# EAGLE design controller (EAGLE 6.4)
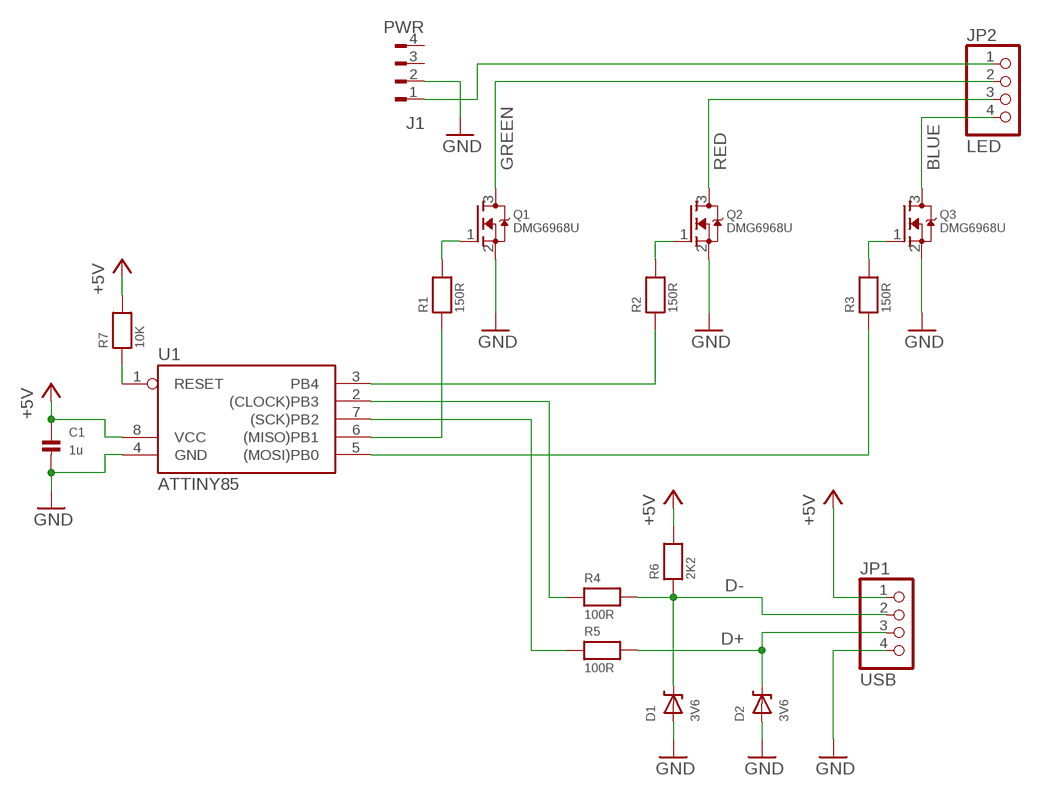
[diagram p0: schematic, sheet 1]

## Parts
C1  1u  CAP_CERAMIC0805  [0805]
D1  3V6  DIODE-ZENERSOD-323  [SOD-323]
D2  3V6  DIODE-ZENERSOD-323  [SOD-323]
J1  PWR  FLOP-4W827001  [827001]
JP1  USB  PINHD-1X4  [1X04]
JP2  LED  PINHD-1X4  [1X04]
Q1  DMG6968U  MOSFET-NWAVE  [SOT23-W]
Q2  DMG6968U  MOSFET-NWAVE  [SOT23-W]
Q3  DMG6968U  MOSFET-NWAVE  [SOT23-W]
R1  150R  RESISTOR0805  [0805]
R2  150R  RESISTOR0805  [0805]
R3  150R  RESISTOR0805  [0805]
R4  100R  RESISTOR0805  [0805]
R5  100R  RESISTOR0805  [0805]
R6  2K2  RESISTOR0805  [0805]
R7  10K  RESISTOR0805  [0805]
U1  ATTINY85  ATTINY85208MIL  [SOIC127P798X216-8N]

## Nets
+5V: C1.1 JP1.1 R6.2 R7.2 U1.8(VCC)
BLUE: JP2.4 Q3.3(D)
D+: D2.C JP1.3 R5.2
D-: D1.C JP1.2 R4.2 R6.1
GND: C1.2 D1.A D2.A J1.2 JP1.4 Q1.2(S) Q2.2(S) Q3.2(S) U1.4(GND)
GREEN: JP2.2 Q1.3(D)
MISO: R1.1 U1.6((MISO)PB1)
MOSI: R3.1 U1.5((MOSI)PB0)
N$1: Q1.1(G) R1.2
N$2: Q2.1(G) R2.2
N$3: Q3.1(G) R3.2
N$7: R4.1 U1.2((CLOCK)PB3)
N$8: J1.1 JP2.1
N$9: R2.1 U1.3(PB4)
RED: JP2.3 Q2.3(D)
RST: R7.1 U1.1(RESET)
SCK: R5.1 U1.7((SCK)PB2)
Unconnected: J1.3 J1.4

## Library data of the parts
C1 = microbuilder:CAP_CERAMIC: Ceramic Capacitors 0402 - 0402 Surface Mount Capacitors 16pF 50V 5% [Digikey: 445-4899-2-ND] 18pF 50V 5% [Digikey: 490-1281-2-ND] 22pF 50V 5% [Digikey: 490-1283-2-ND] 68pF 50V 5% [Digikey: 490-1289-2-ND] 0.1uF 10V 10% [Digikey: 490-1318-2-ND] 1.0uF 6.3V 10% [Digikey: 490-1320-2-ND] 0603 - 0603 Surface Mount Capacitors 16 pF 50V 5% [Digikey: 445-5051-2-ND] 22 pF 50V [Digikey: PCC220ACVTR-ND] 33 pF 50V 5% [Digikey: 490-1415-1-ND] 56pF 50V 5% [Digikey: 490-1421-1-ND] 220pF 50V 5% [Digikey: 445-1285-1-ND] 680 pF 50V 2200 pF 50V 5% C0G [Digikey: 445-1297-1-ND] 5600 pF 100V 5% X7R [Digikey: 478-3711-1-ND] 0.1 µF 25V 10% [Digikey: PCC2277TR-ND] 0.22 µF 16V 10% X7R [Digikey: 445-1318-1-ND] 1.0 µF 25V 10% [Digikey: 445-5146-2-ND] 0603 - RF Specific 3pF 250V +/-0.1pF RF [Digikey: 712-1347-1-ND] 18 pF 250V 5% [Digikey: 478-3505-1-ND or 712-1322-1-ND] 56 pF 250V 5% C0G RF [Digikey: 490-4867-1-ND] 68 pF 250V RF [Digikey: 490-4868-1-ND] 0805 - 0805 Surface Mount Capacitors 220 pF 250V 2% RF Ceramic Capacitor [Digikey: 712-1398-1-ND] 1000 pF 50V 2% NP0 Ceramic Capacitor [Digikey: 478-3760-1-ND] 0.1 µF 25V 10% Ceramic Capacitor [Digikey: PCC1828TR-ND] 1.0 µF 16V 10% Ceramic Capacitor[Digikey: 490-1691-2-ND] 10.0 µF 10V 10% Ceramic Capacitor[Digikey: 709-1228-1-ND] 10.0 uF 16V 10% Ceramic Capacitor [Digikey: 478-5165-2-ND] 47 uF 6.3V 20% Ceramic Capacitor [Digikey: 587-1779-1-ND or 399-5506-1-ND] 1206 - 1206 Surface Mount Capacitors 47uF 10V 20% Ceramic Capacitor [Digikey: 490-5528-1-ND or 399-5508-1-ND or 445-6010-1-ND] 100uF 6.3V -20%, +80% Y5V Ceramic Capacitor (Digikey: 490-4512-1-ND, Mouser: 81-GRM31CF50J107ZE1L)
D1 D2 = zak:DIODE-ZENER
J1 = con-amp:FLOP-4W: MATE N-LOCK Floppy / HDD conector Distributor: Bürklin 71F972
JP1 JP2 = pinhead:PINHD-1X4: PIN HEADER
Q1-Q3 = microbuilder:MOSFET-N: N-Channel Mosfet LEGEND VDS: Voltage Drain-Source ID: Drain Current RDS(ON): Drain-Source On-State Resistance VGS(TH): Gate-Source Threshold Voltage CISS: Drain-Source Input Capacitance SOT-23 Name VDS ID RDS(ON) VGS(TH) CISS Order Number 2N7002E 60V 260mA 2.5 Ohm 2.5V @ 250uA 26.7pF @ 25V 2N7002ET1GOSTR-ND BSH103 30V 850mA 400 mOhm 400mV @ 1mA 83pF @ 24V BSH103,235-ND BSS138 60V 320mA 1.6 Ohm 1.5V @ 250uA 50pF @ 10V Mouser: 771-BSS138PW115 DMN2075U-7 20V 4.2A 38 mOhm 1V @ 250 uA 594.3pF @ 10V DMN2075U-7DICT-ND * BSS138 good choice for I2C level-shifting
R1-R7 = microbuilder:RESISTOR: Resistors 0402 - 0402 Surface Mount Package 22 Ohm 1% 1/16W [Digikey: 311-22.0LRTR-ND] 33 Ohm 5% 1/16W 1.0K 5% 1/16W 1.5K 5% 1/16W 2.0K 1% 1/16W 10.0K 1% 1/16W [Digikey: 311-10.0KLRTR-ND] 10.0K 5% 1/16W [Digikey: RMCF0402JT10K0TR-ND] 12.1K 1% 1/16W [Digikey: 311-22.0LRTR-ND] 100.0K 5% 1/16W 0603 - 0603 Surface Mount Package 0 Ohm 1/10 Watt 1% Resistor 15 Ohm 1/10 Watt 1% Resistor 33 Ohm 1/10 Watt 1% Resistor 49.9 Ohm 1/10 Watt 1% Resistor 100 Ohm 1/10 Watt 1% Resistor 150 Ohm 1/10 Watt 1% Resistor 240 Ohm 1/10 Watt 1% Resistor 390 Ohm 1/10 Watt 1% Resistor 560 Ohm 1/10 Watt 1% Resistor 680 Ohm 1/10 Watt 1% Resistor 750 Ohm 1/10 Watt 1% Resistor 1.0K Ohm 1/10 Watt 1% Resistor 1.5K Ohm 1/10 Watt 1% Resistor 2.0K Ohm 1/10 Watt 1% Resistor 2.2K Ohm 1/10 Watt 1% Resistor 3.3K Ohm 1/10 Watt 1% Resistor 4.7K Ohm 1/10 Watt 1% Resistor 10.0K Ohm 1/10 Watt 1% Resistor 12.0K Ohm 1/10 Watt 1% Resistor 12.1K Ohm 1/10 Watt 1% Resistor 20.0K Ohm 1/10 Watt 1% Resistor 33.0K Ohm 1/10 Watt 1% Resistor 100.0K Ohm 1/10 Watt 1% Resistor 0805 - 0805 Surface Mount Package 0 Ohm 1/8 Watt 1% Resistor 33 Ohm 1/8 Watt 1% Resistor 100 Ohm 1/8 Watt 1% Resistor 150 Ohm 1/8 Watt 1% Resistor 200 Ohm 1/8 Watt 1% Resistor 240 Ohm 1/8 Watt 1% Resistor 330 Ohm 1/8 Watt 1% Resistor 390 Ohm 1/8 Watt 1% Resistor 470 Ohm 1/8 Watt 1% Resistor 1.0K Ohm 1/8 Watt 1% Resistor 1.5K Ohm 1/8 Watt 1% Resistor 2.0K Ohm 1/8 Watt 1% Resistor 4.7K Ohm 1/8 Watt 1% Resistor 5.1K Ohm 1/8 Watt 1% Resistor 5.6K Ohm 1/8 Watt 1% Resistor 10.0K Ohm 1/8 Watt 1% Resistor 22.0K Ohm 1/8 Watt 1% Resistor 33.0K Ohm 1/8 Watt 1% Resistor 100K Ohm 1/8 Watt 1% Resistor 1206 - 1206 Surface Mount Package 2012 - 2010 Surface Mount Package 0.11 Ohm 1/2 Watt 1% Resistor - Digikey: RHM.11UCT-ND
U1 = zak:ATTINY85

## Board
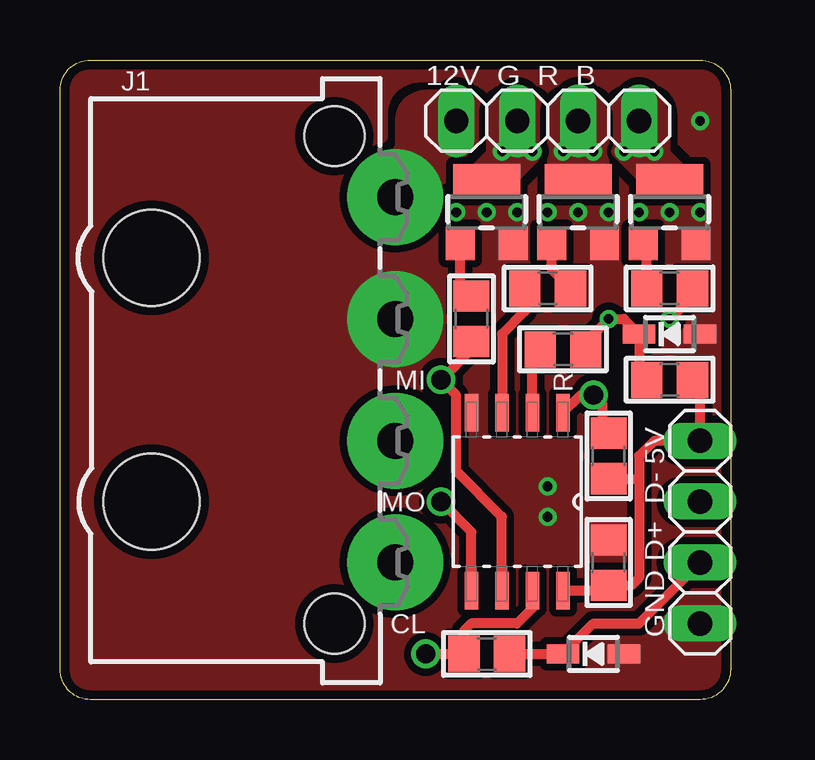
[diagram p1: board, top side]
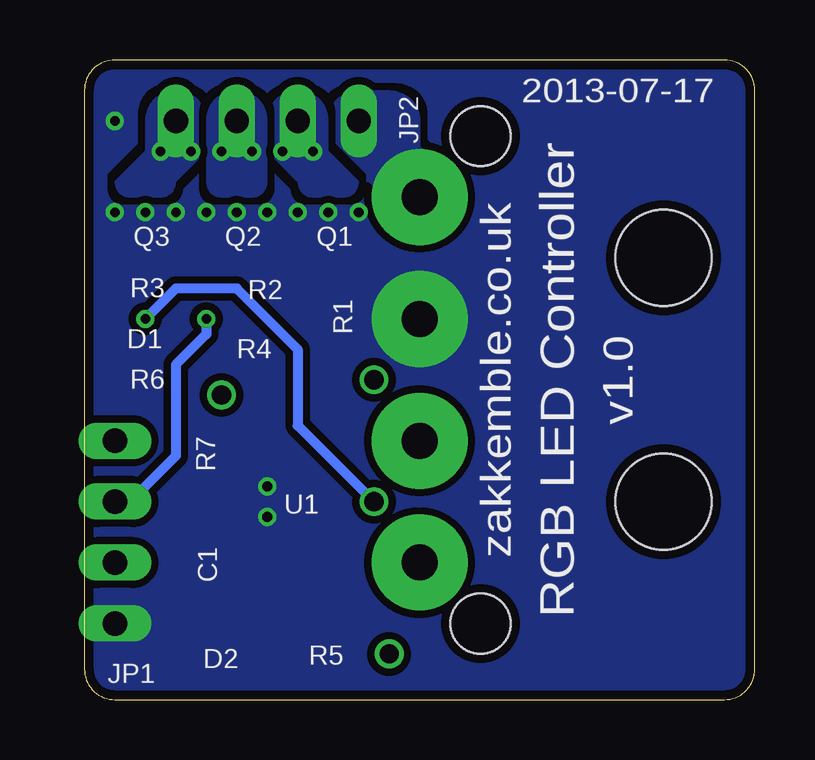
[diagram p2: board, bottom side, seen from below]

Size 27.94 x 26.67 mm. Coordinates in mm from the lower left corner, seen from the top.
Outline: 0,1.27 0,25.4 arc-90 1.27,26.67 26.67,26.67 arc-90 27.94,25.4 27.94,1.27 arc-90 26.67,0 1.27,0 arc-90 0,1.27
Copper layers (1*16): Top 0.0356mm / dielectric 1.5011mm / Bottom 0.0356mm
Design rules "default *": minimum track width 6mil, minimum drill 13mil, track to track 6mil, track to pad 6mil, pad to pad 6mil, via to via 6mil, smd to smd 6mil, copper to edge 15mil, drill to drill 6mil, minimum pad ring 10mil, minimum via ring 7mil, stop-mask expansion 4mil, vias tented up to drill 26mil, thermal gap 10mil

### Footprints (pad centres in the part's own frame; a part is rotated, then mirrored left to right if it is on the bottom)
0805 = smd 1.3 x 1.5: 1 -0.95,0; 2 0.95,0
SOD-323 = smd 1.35 x 0.8: A 1.27,0; C -1.27,0
827001 = drill 1.5 pad 4: 1 -7.62,0; 2 -2.54,0; 3 2.54,0; 4 7.62,0 | hole 4: 5.08,-10.16; -5.08,-10.16 | hole 2.5: 10.16,-2.54; -10.16,-2.54
1X04 = drill 1.016 long: 1 -3.81,0; 2 -1.27,0; 3 1.27,0; 4 3.81,0
SOT23-W = smd 1.2 x 1.4: 1 -1.1,-1.3; 2 1.1,-1.3 | smd 2.8 x 1.4: 3 0,1.3
SOIC127P798X216-8N = smd 0.559 x 1.549: 1 -1.905,-3.708; 2 -0.635,-3.708; 3 0.635,-3.708; 4 1.905,-3.708; 5 1.905,3.708; 6 0.635,3.708; 7 -0.635,3.708; 8 -1.905,3.708

### Placement (x,y rotation side)
C1  22.86,5.71 90 top
D1  25.4,15.24 0 top
D2  22.23,1.91 0 top
J1  13.97,13.34 270 top
JP1  26.67,6.99 270 top
JP2  20.32,24.13 0 top
Q1  17.78,20.32 0 top
Q2  21.59,20.32 0 top
Q3  25.4,20.32 0 top
R1  17.14,15.88 90 top
R2  20.32,17.14 0 top
R3  25.4,17.14 180 top
R4  20.95,14.61 0 top
R5  17.78,1.91 0 top
R6  25.4,13.34 0 top
R7  22.86,10.16 270 top
U1  19.05,8.26 180 top

### Tracks (layer width: path | path; a pad name or v marks a point on that pad's centre or on a via)
+5V
  Top 0.406: R6.2 26.67,13.02 JP1.1 24.77,10.79 24.13,10.16 24.13,9.21 | 24.13,9.21 24.13,5.08 23.82,4.76 C1.1 22.64,4.55 U1.8 | R7.2 24.13,9.21
BLUE  (via drill 0.4)
  other vias: 23.5,22.86 24.77,22.86
  pour Top (rank 2, no thermals): 24.13,20.95 24.13,21.59 22.86,22.86 22.86,24.13 arc-90 24.13,25.4 arc-90 25.4,24.13 25.4,22.86 26.67,21.59 26.67,20.95
  pour Bottom (isolate 0.305, rank 2, no thermals): 24.13,21.59 22.86,22.86 22.86,24.13 arc-90 24.13,25.4 arc-90 25.4,24.13 25.4,22.86 26.67,21.59 arc-90 26.04,20.95 24.77,20.95 arc-90
D+
  Top 0.406: R5.2 D2.C 22.23,3.17 24.13,3.17 JP1.3
D-  (via drill 0.4)
  Top 0.406: R4.2 21.91,14.92 v22.86,15.88 23.5,15.88 D1.C 24.13,13.65 R6.1
  Bottom 0.406: JP1.2 26.04,8.26 24.13,10.16 24.13,13.97 22.86,15.24 v22.86,15.88
GND  (via drill 0.4)
  other vias: 25.4,20.32 21.59,20.32 17.78,20.32 20.32,8.89 20.32,7.62 19.05,20.32 22.86,20.32 26.67,20.32 24.13,20.32 20.32,20.32 16.51,20.32 26.67,24.13
  pour Bottom (isolate 0.305, rank 6, no thermals): 0,26.67 27.94,26.67 27.94,0 0,0
  pour Top (isolate 0.305, rank 6, no thermals): 0,26.67 27.94,26.67 27.94,0 0,0
GREEN  (via drill 0.4)
  other vias: 18.41,22.86 19.68,22.86
  pour Top (isolate 0.305, rank 2, no thermals): 16.51,20.95 16.51,21.59 17.78,22.86 17.78,24.13 arc-90 19.05,25.4 arc-90 20.32,24.13 20.32,22.86 19.05,21.59 19.05,20.95
  pour Bottom (isolate 0.305, rank 2, no thermals): 16.51,21.59 17.78,22.86 17.78,24.13 arc-90 19.05,25.4 arc-90 20.32,24.13 20.32,22.86 19.05,21.59 arc-90 18.41,20.95 17.14,20.95 arc-90
MISO  (via drill 0.8)
  Top 0.406: U1.6 18.41,7.62 16.51,9.53 16.51,12.7 v15.88,13.34 17.14,14.61 R1.1
MOSI  (via drill 0.4, 0.8)
  Top 0.406: v25.4,15.88 26.35,16.82 R3.1 | v15.88,8.26 17.14,6.99 U1.5
  Bottom 0.406: v15.88,8.26 19.05,11.43 19.05,14.61 21.59,17.14 24.13,17.14 v25.4,15.88
N$1
  Top 0.406: R1.2 16.68,16.82 Q1.1
N$2
  Top 0.406: R2.2 20.49,17.93 Q2.1
N$3
  Top 0.406: R3.2 24.45,18.87 Q3.1
N$7
  Top 0.406: U1.2 19.68,14.29 R4.1
N$8
  pour Top (isolate 0.305, rank 3, no thermals): 16.51,25.4 15.24,25.4 arc90 13.97,24.13 13.97,23.18 arc-90 13.65,22.86 13.65,22.54 12.7,21.59 12.7,20.32 13.97,19.05 15.24,20.32 15.56,20.32 15.88,20.64 15.88,21.27 arc-90 16.19,21.59 16.51,21.59 17.78,22.86 17.78,24.13 arc90
  pour Bottom (isolate 0.305, rank 3, no thermals): 16.51,25.4 15.24,25.4 arc90 13.97,24.13 13.97,23.18 arc-90 13.65,22.86 13.65,22.54 12.7,21.59 12.7,20.32 13.97,19.05 15.24,20.32 15.56,20.32 15.88,20.64 15.88,21.27 arc-90 16.19,21.59 16.51,21.59 17.78,22.86 17.78,24.13 arc90
N$9
  Top 0.406: U1.3 18.43,11.97 18.43,15.25 19.37,16.2 R2.1
RED  (via drill 0.4)
  other vias: 20.95,22.86 22.23,22.86
  pour Top (isolate 0.305, no thermals): 20.32,20.95 20.32,24.13 arc-90 21.59,25.4 arc-90 22.86,24.13 22.86,20.95
  pour Bottom (isolate 0.305, no thermals): 20.32,21.59 20.32,24.13 arc-90 21.59,25.4 arc-90 22.86,24.13 22.86,21.59 arc-90 22.23,20.95 20.95,20.95 arc-90
RST  (via drill 0.8)
  Top 0.406: R7.1 22.61,11.49 22.61,12.32 v22.23,12.7 21.69,12.7 U1.1
SCK  (via drill 0.8)
  Top 0.406: U1.7 19.68,3.81 19.05,3.17 17.14,3.17 16.83,2.86 R5.1 v15.24,1.91

### Text on the board
tPlace: R | MI | MO | CL
bPlace: 2013-07-17 | v1.0 | RGB LED Controller | zakkemble.co.uk
tNames: 12V G R B | GND D+ D- 5V